# EAGLE board smrf-v1.0.1b (EAGLE 7.3.0), part 1 of 3
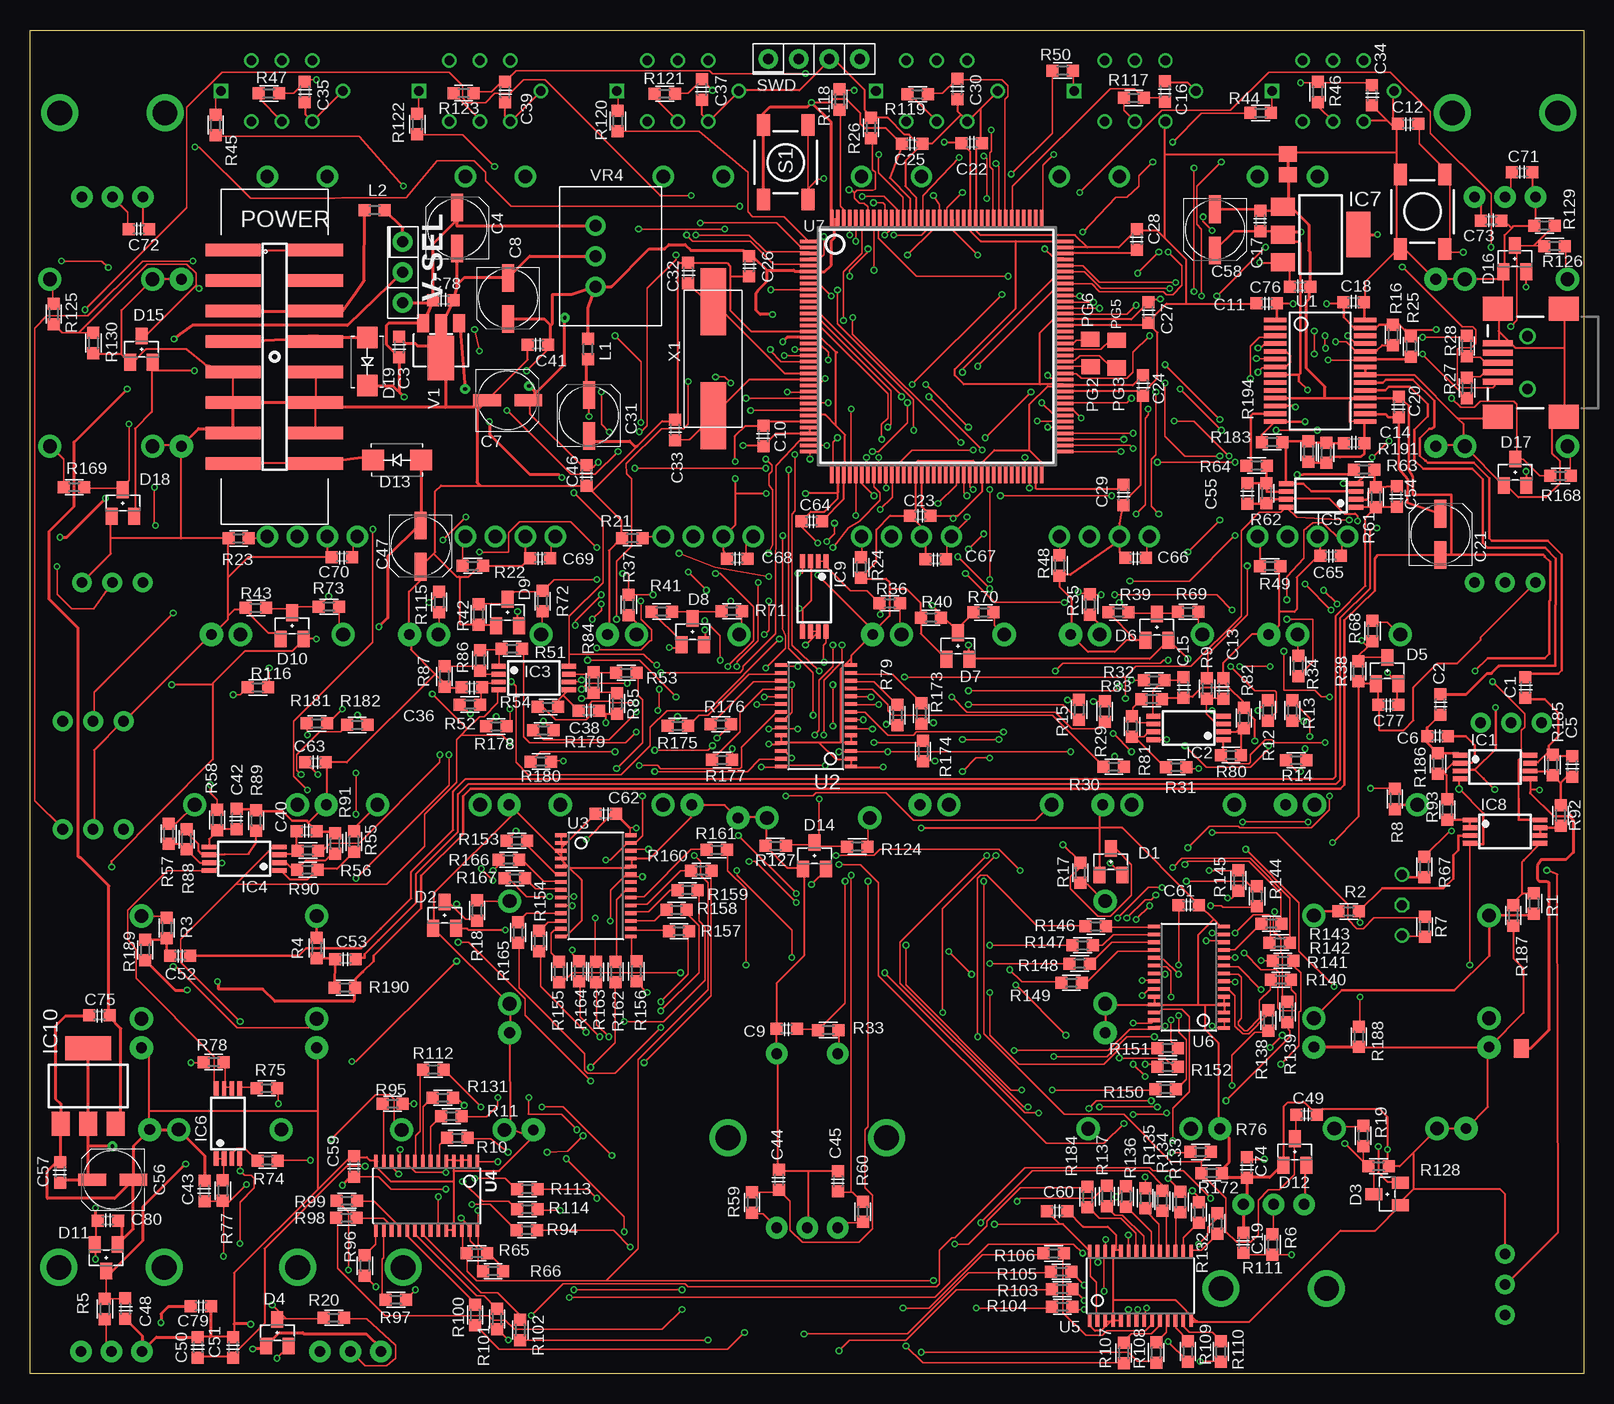
[diagram p6: board, top side]
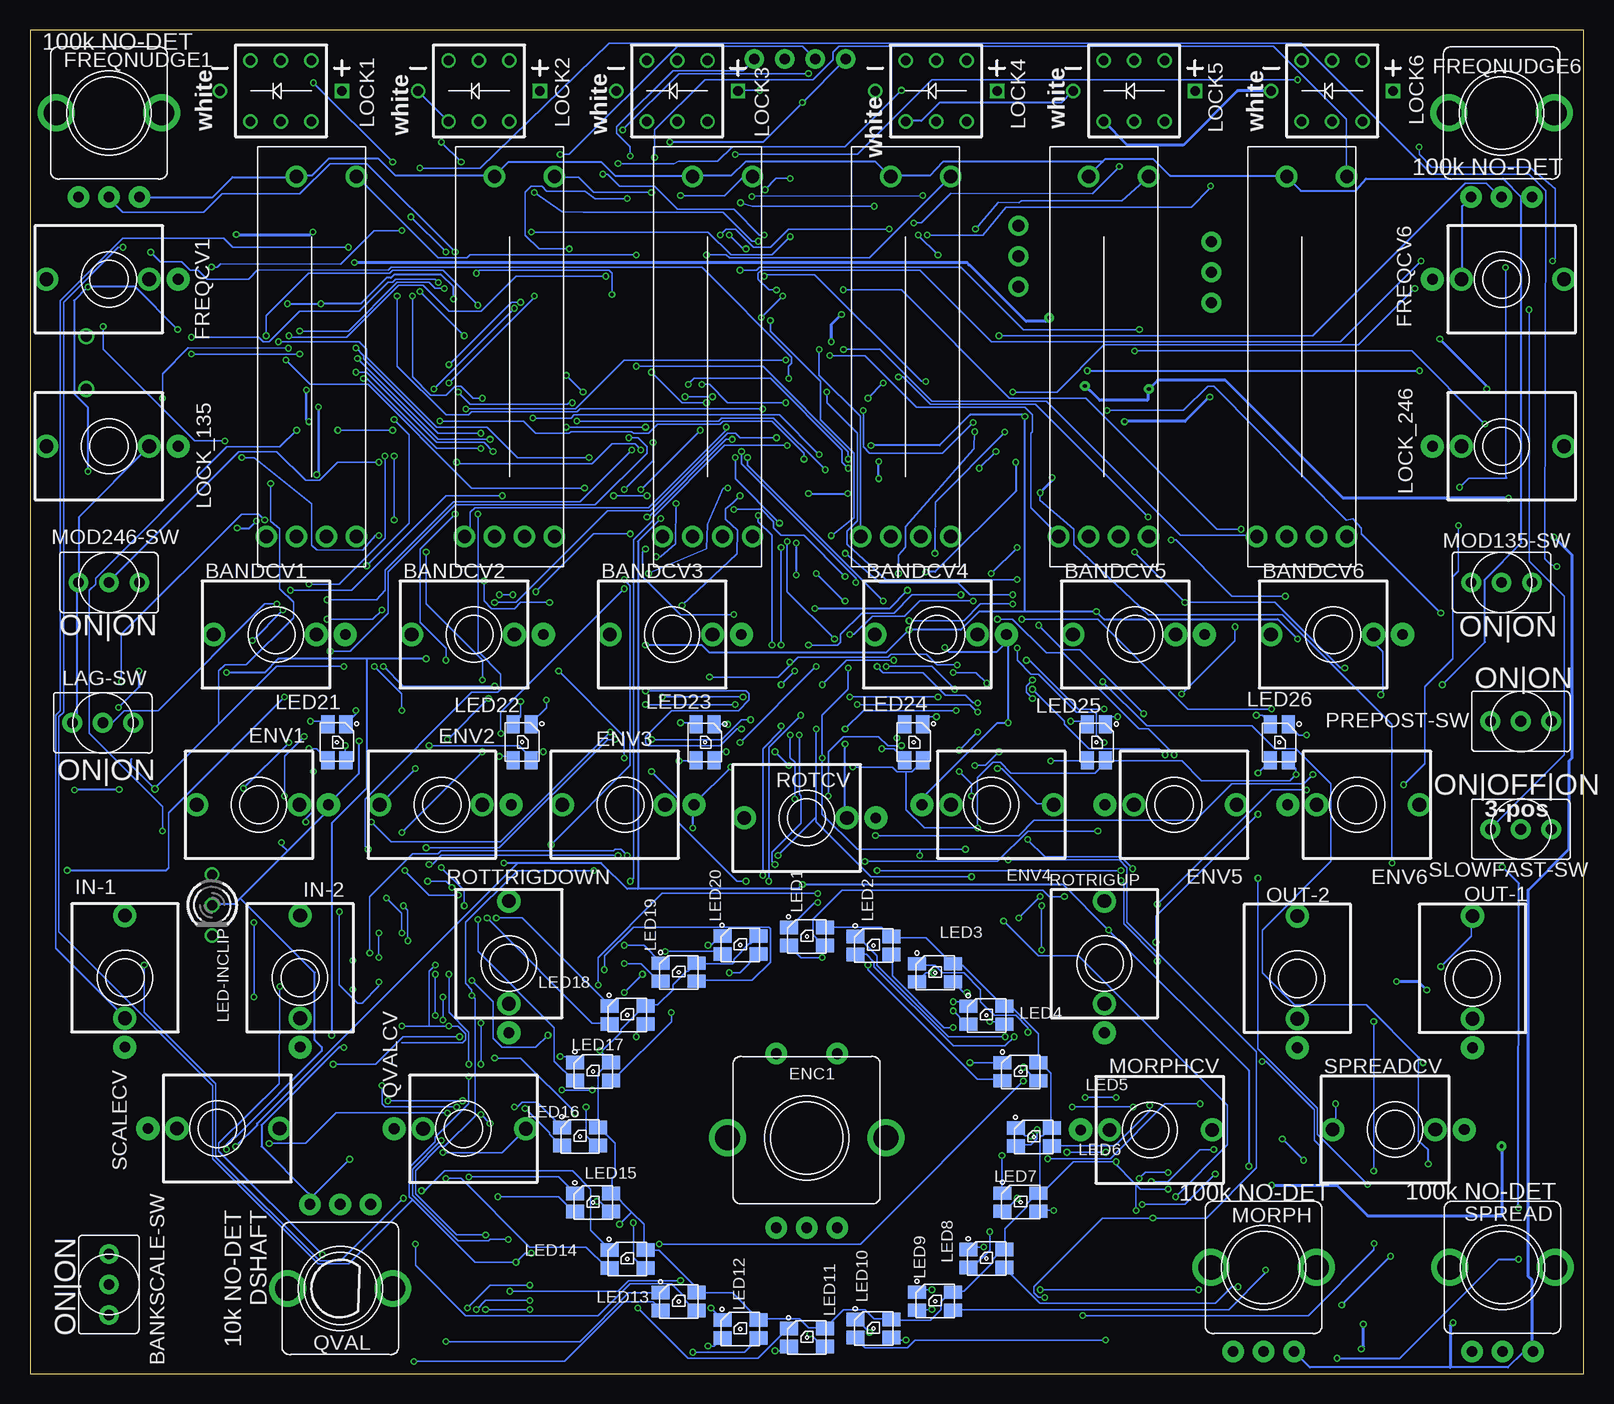
[diagram p7: board, bottom side, seen from below]

Size 129.54 x 111.96 mm. Coordinates in mm from the lower left corner, seen from the top.
Outline: 0,0 0,111.96 129.54,111.96 129.54,0 0,0
Copper layers (1*16): Top 0.035mm / dielectric 1.5mm / Bottom 0.035mm
Design rules "default *": minimum track width 5mil, minimum drill 12mil, track to track 5mil, track to pad 5mil, pad to pad 5mil, via to via 5mil, smd to smd 5mil, copper to edge 10mil, drill to drill 5mil, minimum pad ring 5mil, minimum via ring 5mil, stop-mask expansion 4mil, vias tented up to drill 12mil, thermal gap 5mil
Net classes: 1 power: width 0.178 mm, drill 0.305 mm, clearance 0.178 mm to class 0, clearance 0.178 mm

## Footprints (pad centres in the part's own frame; a part is rotated, then mirrored left to right if it is on the bottom)
PAD-06 = smd 1.524 x 1.27: P$1 0,0
PJ301M-12-FIX = drill 1.143 pad 1.93: 1 -5.207,0; 3 3.353,0 | drill 0.889 pad 1.93: 2 5.766,0
SPDT-SUB = drill 0.889 pad 1.651: P$1 0,2.54; P$2 0,0; P$3 0,-2.54
C0603 = smd 1 x 1: 1 -0.85,0; 2 0.85,0
C-POL-5 = smd 2.3 x 1: + 1.725,0; - -1.7,0
SOT23 = smd 1 x 1.4: 1 -0.95,-1.1; 2 0.95,-1.1; 3 0,1.1
SMA = smd 1.8 x 1.7: A -2,0; K 2,0
ROTENC-12MM-BUT = drill 0.889 pad 1.803: 1 -2.54,-7.493; 2 0,-7.493; 3 2.54,-7.493; SW1 -2.54,7.01; SW2 2.54,7.01 | drill 2.057 pad 2.667: P$4 -6.604,0; P$5 6.604,0
POT-9MM-SONGHUEI = drill 0.889 pad 1.803: 1 -2.54,-7.01; 2 0,-7.01; 3 2.54,-7.01 | drill 2.057 pad 2.667: P$4 -4.394,0; P$5 4.394,0
TSSOP8 = smd 0.4 x 1.2: 1 -0.975,-2.925; 2 -0.325,-2.925; 3 0.325,-2.925; 4 0.975,-2.925; 5 0.975,2.925; 6 0.325,2.925; 7 -0.325,2.925; 8 -0.975,2.925
SOT223 = smd 1.5 x 2: 1 -2.3,-3.15; 2 0,-3.15; 3 2.3,-3.15 | smd 3.8 x 2: 4 0,3.15
0603 = smd 1 x 1: 1 -0.85,0; 2 0.85,0
PLCC4 = smd 1.5 x 1.1: P$1 -1.5,0.75; P$2 1.5,0.75; P$3 1.5,-0.75; P$4 -1.5,-0.75
LED-T1X2 = drill 0.813: A-1 2.54,0; A-3 -2.54,0 | drill 0.813 octagon: K-2 0,0
BUTTON-LED-PB61303 = drill 0.8: P$1 2.54,2.54; P$2 0,2.54; P$3 -2.54,2.54; P$4 2.54,-2.54; P$5 0,-2.54; P$6 -2.54,-2.54; P$8 -5.08,0 | drill 0.8 square: P$7 5.08,0
HEADER-2X8-SMT-SHROUDED = smd 1.016 x 4.572: 1 -8.89,-3.458; 2 -8.89,3.407; 3 -6.35,-3.458; 4 -6.35,3.407; 5 -3.81,-3.458; 6 -3.81,3.407; 7 -1.27,-3.458; 8 -1.27,3.407; 9 1.27,-3.458; 10 1.27,3.407; 11 3.81,-3.458; 12 3.81,3.407; 13 6.35,-3.458; 14 6.35,3.407; 15 8.89,-3.458; 16 8.89,3.407
R0603 = smd 1 x 1: 1 -0.85,0; 2 0.85,0
BUTTON-TACT-SKQG = smd 1.8 x 1.1: 1 -3.1,1.85; 2 3.1,1.85; 3 -3.1,-1.85; 4 3.1,-1.85
POT-SLIDER-ALPHA-RA2045F-20 = drill 1.1 pad 1.778: P$1 -15,1.25; P$2 -15,3.75; P$3 15,1.25; P$LEDA 15,-3.75; P$LEDC -15,-3.75; P$NC -15,-1.25
HEADER-1X4-TH = drill 0.9 pad 1.651: P$1 0,3.81; P$2 0,1.27; P$3 0,-1.27; P$4 0,-3.81
28-SSOP = smd 0.381 x 1.905: P$1 -4.55,-3.752; P$2 -3.9,-3.752; P$3 -3.25,-3.752; P$4 -2.6,-3.752; P$5 -1.95,-3.752; P$6 -1.3,-3.752; P$7 -0.65,-3.752; P$8 0,-3.752; P$9 0.65,-3.752; P$10 1.3,-3.752; P$11 1.95,-3.752; P$12 2.6,-3.752; P$13 3.25,-3.752; P$14 3.9,-3.752; P$15 3.9,3.752; P$16 3.25,3.752; P$17 2.6,3.752; P$18 1.95,3.752; P$19 1.3,3.752; P$20 0.65,3.752; P$21 0,3.752; P$22 -0.65,3.752; P$23 -1.3,3.752; P$24 -1.95,3.752; P$25 -2.6,3.752; P$26 -3.25,3.752; P$27 -3.9,3.752; P$28 -4.55,3.752
TSSOP28 = smd 0.305 x 0.991: 1 -4.225,-2.918; 2 -3.575,-2.918; 3 -2.925,-2.918; 4 -2.275,-2.918; 5 -1.625,-2.918; 6 -0.975,-2.918; 7 -0.325,-2.918; 8 0.325,-2.918; 9 0.975,-2.918; 10 1.625,-2.918; 11 2.275,-2.918; 12 2.925,-2.918; 13 3.575,-2.918; 14 4.225,-2.918; 15 4.225,2.918; 16 3.575,2.918; 17 2.925,2.918; 18 2.275,2.918; 19 1.625,2.918; 20 0.975,2.918; 21 0.325,2.918; 22 -0.325,2.918; 23 -0.975,2.918; 24 -1.625,2.918; 25 -2.275,2.918; 26 -2.925,2.918; 27 -3.575,2.918; 28 -4.225,2.918
LQFP144 = smd 0.3 x 1.6: 1 -8.75,-10.6; 2 -8.25,-10.6; 3 -7.75,-10.6; 4 -7.25,-10.6; 5 -6.75,-10.6; 6 -6.25,-10.6; 7 -5.75,-10.6; 8 -5.25,-10.6; 9 -4.75,-10.6; 10 -4.25,-10.6; 11 -3.75,-10.6; 12 -3.25,-10.6; 13 -2.75,-10.6; 14 -2.25,-10.6; 15 -1.75,-10.6; 16 -1.25,-10.6; 17 -0.75,-10.6; 18 -0.25,-10.6; 19 0.25,-10.6; 20 0.75,-10.6; 21 1.25,-10.6; 22 1.75,-10.6; 23 2.25,-10.6; 24 2.75,-10.6; 25 3.25,-10.6; 26 3.75,-10.6; 27 4.25,-10.6; 28 4.75,-10.6; 29 5.25,-10.6; 30 5.75,-10.6; 31 6.25,-10.6; 32 6.75,-10.6; 33 7.25,-10.6; 34 7.75,-10.6; 35 8.25,-10.6; 36 8.75,-10.6; 73 8.75,10.6; 74 8.25,10.6; 75 7.75,10.6; 76 7.25,10.6; 77 6.75,10.6; 78 6.25,10.6; 79 5.75,10.6; 80 5.25,10.6; 81 4.75,10.6; 82 4.25,10.6; 83 3.75,10.6; 84 3.25,10.6; 85 2.75,10.6; 86 2.25,10.6; 87 1.75,10.6; 88 1.25,10.6; 89 0.75,10.6; 90 0.25,10.6; 91 -0.25,10.6; 92 -0.75,10.6; 93 -1.25,10.6; 94 -1.75,10.6; 95 -2.25,10.6; 96 -2.75,10.6; 97 -3.25,10.6; 98 -3.75,10.6; 99 -4.25,10.6; 100 -4.75,10.6; 101 -5.25,10.6; 102 -5.75,10.6; 103 -6.25,10.6; 104 -6.75,10.6; 105 -7.25,10.6; 106 -7.75,10.6; 107 -8.25,10.6; 108 -8.75,10.6 | smd 1.6 x 0.3: 37 10.6,-8.75; 38 10.6,-8.25; 39 10.6,-7.75; 40 10.6,-7.25; 41 10.6,-6.75; 42 10.6,-6.25; 43 10.6,-5.75; 44 10.6,-5.25; 45 10.6,-4.75; 46 10.6,-4.25; 47 10.6,-3.75; 48 10.6,-3.25; 49 10.6,-2.75; 50 10.6,-2.25; 51 10.6,-1.75; 52 10.6,-1.25; 53 10.6,-0.75; 54 10.6,-0.25; 55 10.6,0.25; 56 10.6,0.75; 57 10.6,1.25; 58 10.6,1.75; 59 10.6,2.25; 60 10.6,2.75; 61 10.6,3.25; 62 10.6,3.75; 63 10.6,4.25; 64 10.6,4.75; 65 10.6,5.25; 66 10.6,5.75; 67 10.6,6.25; 68 10.6,6.75; 69 10.6,7.25; 70 10.6,7.75; 71 10.6,8.25; 72 10.6,8.75; 109 -10.6,8.75; 110 -10.6,8.25; 111 -10.6,7.75; 112 -10.6,7.25; 113 -10.6,6.75; 114 -10.6,6.25; 115 -10.6,5.75; 116 -10.6,5.25; 117 -10.6,4.75; 118 -10.6,4.25; 119 -10.6,3.75; 120 -10.6,3.25; 121 -10.6,2.75; 122 -10.6,2.25; 123 -10.6,1.75; 124 -10.6,1.25; 125 -10.6,0.75; 126 -10.6,0.25; 127 -10.6,-0.25; 128 -10.6,-0.75; 129 -10.6,-1.25; 130 -10.6,-1.75; 131 -10.6,-2.25; 132 -10.6,-2.75; 133 -10.6,-3.25; 134 -10.6,-3.75; 135 -10.6,-4.25; 136 -10.6,-4.75; 137 -10.6,-5.25; 138 -10.6,-5.75; 139 -10.6,-6.25; 140 -10.6,-6.75; 141 -10.6,-7.25; 142 -10.6,-7.75; 143 -10.6,-8.25; 144 -10.6,-8.75
USB-MINIB = smd 2.5 x 0.5: D+ 2.5,0; D- 2.5,0.8; GND 2.5,-1.6; ID 2.5,-0.8; VBUS 2.5,1.6 | smd 2.5 x 2: MTN1 -3,4.5; MTN2 2.5,4.5; MTN3 -3,-4.5; MTN4 2.5,-4.5 | drill 0.9 pad 1.306: P$1 0,2.2; P$2 0,-2.2
SOT89 = smd 1 x 1.5: 1 -1.5,-2; 3 1.5,-2 | smd 1 x 1.8: 2A 0,-1.85 | smd 2.2 x 3.7: 2B 0,0.9
HEADER-1X3-TH = drill 0.9 pad 1.651: P$1 0,2.54; P$2 0,0; P$3 0,-2.54
RECOM-DCDC = drill 1 pad 1.676: P$1 -2.54,0; P$2 0,0; P$3 2.54,0
HC-49/US = smd 5.588 x 2.108: 1 -4.75,0; 2 4.75,0

## Placement (x,y rotation side)
AGND  [PAD-06]  104.85,99.9 0 top
AGND-OPT  [PAD-06]  124.31,27.08 90 top
BANDCV1  PJ301-M12  [PJ301M-12-FIX]  109.02,61.59 0 bottom
BANDCV2  PJ301-M12  [PJ301M-12-FIX]  92.51,61.59 0 bottom
BANDCV3  PJ301-M12  [PJ301M-12-FIX]  76,61.59 0 bottom
BANDCV4  PJ301-M12  [PJ301M-12-FIX]  53.91,61.59 0 bottom
BANDCV5  PJ301-M12  [PJ301M-12-FIX]  37.4,61.59 0 bottom
BANDCV6  PJ301-M12  [PJ301M-12-FIX]  20.89,61.59 0 bottom
BANKSCALE-SW  submini-2T  [SPDT-SUB]  122.96,7.42 0 bottom
C1  10uF/10V  [C0603]  124.66,57.18 270 top
C2  10uF/10V  [C0603]  117.55,55.75 270 top
C3  0.1uF  [C0603]  30.78,85.55 90 top
C4  47uF  [C-POL-5]  35.61,95.45 90 top
C5  18pF  [C0603]  128.55,50.6 270 top
C6  18pF  [C0603]  117.32,53.11 0 top
C7  47uF  [C-POL-5]  39.8,81.1 0 top
C8  47uF  [C-POL-5]  39.85,89.61 270 top
C9  0.1uF  [C0603]  63.07,28.73 180 top
C10  0.1uF  [C0603]  61.14,78.13 90 top
C11  0.1uF  [C0603]  103.1,89.2 180 top
C12  0.1uF  [C0603]  114.88,104.14 180 top
C13  0.1uF  [C0603]  99.49,57.07 90 top
C14  2.2uF  [C0603]  110.36,77.55 0 top
C15  0.1uF  [C0603]  96.16,57.18 270 top
C16  0.1uF  [C0603]  94.61,106.83 90 top
C17  0.1uF  [C0603]  102.57,96.06 90 top
C18  0.1uF  [C0603]  110.34,89.28 0 top
C19  0.1uF  [C0603]  101.14,10.9 90 top
C20  0.1uF  [C0603]  114.1,80.54 90 top
C21  47uF  [C-POL-5]  117.58,69.93 90 top
C22  0.1uF  [C0603]  78.51,102.54 0 top
C23  0.1uF  [C0603]  74.22,71.5 180 top
C24  0.1uF  [C0603]  92.79,82.35 270 top
C25  0.1uF  [C0603]  73.53,102.46 0 top
C26  0.1uF  [C0603]  59.94,92.28 270 top
C27  0.1uF  [C0603]  93.22,88.42 270 top
C28  2.2uF  [C0603]  92.28,94.51 90 top
C29  2.2uF  [C0603]  91.14,73.23 270 top
C30  0.1uF  [C0603]  77.29,107.04 270 top
C31  47uF  [C-POL-5]  46.58,79.83 90 top
C32  18pF  [C0603]  54.86,91.72 270 top
C33  18pF  [C0603]  53.77,78.64 270 top
C34  0.1uF  [C0603]  111.86,106.53 270 top
C35  0.1uF  [C0603]  22.91,106.81 270 top
C36  0.1uF  [C0603]  36.83,57.18 180 top
C37  0.1uF  [C0603]  56.01,107.01 270 top
C38  0.1uF  [C0603]  46.58,55.22 0 top
C39  0.1uF  [C0603]  39.6,106.78 270 top
C40  0.1uF  [C0603]  23.06,45.21 0 top
C41  0.1uF  [C0603]  42.34,85.75 180 top
C42  0.1uF  [C0603]  17.22,46.23 90 top
C43  0.1uF  [C0603]  14.55,15.21 90 top
C44  0.1uF  [C0603]  62.43,16.15 90 top
C45  0.1uF  [C0603]  67.36,16.03 90 top
C46  0.1uF  [C0603]  46.41,74.85 90 top
C47  47uF  [C-POL-5]  32.56,68.96 270 top
C48  0.1uF  [C0603]  7.95,5.41 270 top
C49  0.1uF  [C0603]  106.4,21.56 0 top
C50  0.1uF  [C0603]  14,2.18 90 top
C51  18pF  [C0603]  16.94,2.18 90 top
C52  10uF/10V  [C0603]  12.52,34.82 180 top
C53  10uF/10V  [C0603]  26.29,34.54 180 top
C54  18pF  [C0603]  113.92,73.08 90 top
C55  18pF  [C0603]  101.5,73.33 90 top
C56  47uF  [C-POL-5]  6.91,16.15 180 top
C57  0.1uF  [C0603]  2.51,16.76 90 top
C58  47uF  [C-POL-5]  98.78,95.33 270 top
C59  0.1uF  [C0603]  27.03,17.25 90 top
C60  0.1uF  [C0603]  85.62,13.51 0 top
C61  0.1uF  [C0603]  96.57,39.01 0 top
C62  0.1uF  [C0603]  48.01,46.63 180 top
C63  0.1uF  [C0603]  23.8,50.93 0 top
C64  0.1uF  [C0603]  65.15,71.04 180 top
C65  0.1uF  [C0603]  108.43,68.15 180 top
C66  0.1uF  [C0603]  92.15,67.97 180 top
C67  0.1uF  [C0603]  75.49,67.84 180 top
C68  0.1uF  [C0603]  58.95,67.92 180 top
C69  0.1uF  [C0603]  42.52,67.94 180 top
C70  0.1uF  [C0603]  26.01,68.02 180 top
C71  0.1uF  [C0603]  124.38,100.1 0 top
C72  0.1uF  [C0603]  9.07,95.35 0 top
C73  0.1uF  [C0603]  121.79,96.09 0 top
C74  0.1uF  [C0603]  101.42,17.17 270 top
C75  0.1uF  [C0603]  5.79,29.84 180 top
C76  0.1uF  [C0603]  105.87,90.58 0 top
C77  0.1uF  [C0603]  113.23,55.73 180 top
C78  0.1uF  [C0603]  34.47,89.46 0 top
C79  0.1uF  [C0603]  14.25,5.61 180 top
C80  0.1uF  [C0603]  6.5,12.75 0 top
D1  BAT54S  [SOT23]  90.09,42.65 0 top
D2  BAT54S  [SOT23]  34.57,38.2 0 top
D3  BAT54S  [SOT23]  113.13,14.96 90 top
D4  BAT54S  [SOT23]  20.62,3.4 0 top
D5  BAT54S  [SOT23]  113.13,58.57 0 top
D6  BAT54S  [SOT23]  93.93,62.2 0 top
D7  BAT54S  [SOT23]  77.34,60.63 0 top
D8  BAT54S  [SOT23]  55.24,61.82 0 top
D9  BAT54S  [SOT23]  39.8,63.42 0 top
D10  BAT54S  [SOT23]  21.84,62.31 0 top
D11  BAT54S  [SOT23]  6.35,9.65 180 top
D12  BAT54S  [SOT23]  105.44,18.47 0 top
D13  B140-E3  [SMA]  30.61,76.12 180 top
D14  BAT54S  [SOT23]  65.41,43.15 0 top
D15  BAT54S  [SOT23]  9.3,85.37 0 top
D16  BAT54S  [SOT23]  123.77,92.91 0 top
D17  BAT54S  [SOT23]  123.8,75.11 0 top
D18  BAT54S  [SOT23]  7.75,72.54 0 top
D19  B140-E3  [SMA]  28.12,84.33 270 top
DGND  [PAD-06]  104.85,101.63 0 top
ENC1  ROTENC-BUTTON-A  [ROTENC-12MM-BUT]  64.79,19.65 0 bottom
ENV1  PJ301-M12  [PJ301M-12-FIX]  110.43,47.4 0 bottom
ENV2  PJ301-M12  [PJ301M-12-FIX]  95.19,47.4 0 bottom
ENV3  PJ301-M12  [PJ301M-12-FIX]  79.95,47.4 0 bottom
ENV4  PJ301-M12  [PJ301M-12-FIX]  49.41,47.4 180 bottom
ENV5  PJ301-M12  [PJ301M-12-FIX]  34.17,47.4 180 bottom
ENV6  PJ301-M12  [PJ301M-12-FIX]  18.93,47.4 180 bottom
FREQCV1  PJ301-M12  [PJ301M-12-FIX]  122.96,91.19 0 bottom
FREQCV6  PJ301-M12  [PJ301M-12-FIX]  6.87,91.19 180 bottom
FREQNUDGE1  100k  [POT-9MM-SONGHUEI]  122.96,105.05 0 bottom
FREQNUDGE6  100k  [POT-9MM-SONGHUEI]  6.87,105.05 0 bottom
IC1  TL082  [TSSOP8]  122.12,50.55 270 top
IC2  TL082  [TSSOP8]  96.57,53.8 90 top
IC3  TL082  [TSSOP8]  41.99,57.96 270 top
IC4  TL082  [TSSOP8]  17.86,42.9 90 top
IC5  TL082  [TSSOP8]  107.62,73.18 90 top
IC6  TL082  [TSSOP8]  16.5,20.84 0 top
IC7  LD1117-33  [SOT223]  107.59,94.92 270 top
IC8  TL082  [TSSOP8]  122.96,45.16 270 top
IC9  TL082  [TSSOP8]  65.38,64.77 180 top
IC10  LD1117-33  [SOT223]  4.85,23.95 0 top
IN-1  PJ301-M12  [PJ301M-12-FIX]  121.63,32.97 270 bottom
IN-2  PJ301-M12  [PJ301M-12-FIX]  107.03,32.97 270 bottom
L1  BEAD  [0603]  46.51,85.37 270 top
L2  BEAD  [0603]  28.73,96.95 0 top
LAG-SW  submini-2T  [SPDT-SUB]  123.47,54.23 90 bottom
LED1  LED-RGB-CA-HEBEI  [PLCC4]  64.78,36.43 0 bottom
LED2  LED-RGB-CA-HEBEI  [PLCC4]  59.22,35.68 0 bottom
LED3  LED-RGB-CA-HEBEI  [PLCC4]  54.09,33.4 0 bottom
LED4  LED-RGB-CA-HEBEI  [PLCC4]  49.8,29.85 0 bottom
LED5  LED-RGB-CA-HEBEI  [PLCC4]  46.96,25.14 0 bottom
LED6  LED-RGB-CA-HEBEI  [PLCC4]  45.86,19.72 0 bottom
LED7  LED-RGB-CA-HEBEI  [PLCC4]  46.96,14.29 0 bottom
LED8  LED-RGB-CA-HEBEI  [PLCC4]  49.8,9.58 0 bottom
LED9  LED-RGB-CA-HEBEI  [PLCC4]  54.09,6.03 0 bottom
LED10  LED-RGB-CA-HEBEI  [PLCC4]  59.22,3.75 0 bottom
LED11  LED-RGB-CA-HEBEI  [PLCC4]  64.78,3 0 bottom
LED12  LED-RGB-CA-HEBEI  [PLCC4]  70.33,3.72 0 bottom
LED13  LED-RGB-CA-HEBEI  [PLCC4]  75.46,6 0 bottom
LED14  LED-RGB-CA-HEBEI  [PLCC4]  79.75,9.55 0 bottom
LED15  LED-RGB-CA-HEBEI  [PLCC4]  82.59,14.25 0 bottom
LED16  LED-RGB-CA-HEBEI  [PLCC4]  83.69,19.75 0 bottom
LED17  LED-RGB-CA-HEBEI  [PLCC4]  82.59,25.18 0 bottom
LED18  LED-RGB-CA-HEBEI  [PLCC4]  79.75,29.88 0 bottom
LED19  LED-RGB-CA-HEBEI  [PLCC4]  75.46,33.43 0 bottom
LED20  LED-RGB-CA-HEBEI  [PLCC4]  70.33,35.71 0 bottom
LED21  LED-RGB-CA-HEBEI  [PLCC4]  103.95,52.62 270 bottom
LED22  LED-RGB-CA-HEBEI  [PLCC4]  88.52,52.63 270 bottom
LED23  LED-RGB-CA-HEBEI  [PLCC4]  73.28,52.6 270 bottom
LED24  LED-RGB-CA-HEBEI  [PLCC4]  55.88,52.62 270 bottom
LED25  LED-RGB-CA-HEBEI  [PLCC4]  40.64,52.6 270 bottom
LED26  LED-RGB-CA-HEBEI  [PLCC4]  25.4,52.6 270 bottom
LED-INCLIP  LEDX2A  [LED-T1X2]  114.36,39.03 270 bottom
LOCK1  WHITE-MOM  [BUTTON-LED-PB61303]  108.62,106.89 0 bottom
LOCK2  WHITE-MOM  [BUTTON-LED-PB61303]  92.11,106.89 0 bottom
LOCK3  WHITE-MOM  [BUTTON-LED-PB61303]  75.6,106.89 0 bottom
LOCK4  WHITE-MOM  [BUTTON-LED-PB61303]  54.01,106.89 0 bottom
LOCK5  WHITE-MOM  [BUTTON-LED-PB61303]  37.5,106.89 0 bottom
LOCK6  WHITE-MOM  [BUTTON-LED-PB61303]  20.99,106.89 0 bottom
LOCK_135  PJ301-M12  [PJ301M-12-FIX]  122.96,77.28 0 bottom
LOCK_246  PJ301-M12  [PJ301M-12-FIX]  6.87,77.28 180 bottom
MOD135-SW  submini-2T  [SPDT-SUB]  6.87,65.92 270 bottom
MOD246-SW  submini-2T  [SPDT-SUB]  122.96,65.92 90 bottom
MORPH  100k  [POT-9MM-SONGHUEI]  26.71,8.84 0 bottom
MORPHCV  PJ301-M12  [PJ301M-12-FIX]  36.2,20.3 180 bottom
OUT-1  PJ301-M12  [PJ301M-12-FIX]  9.29,32.92 270 bottom
OUT-2  PJ301-M12  [PJ301M-12-FIX]  23.89,32.92 270 bottom
PG2  [PAD-06]  88.42,83.9 0 top
PG3  [PAD-06]  90.58,83.79 180 top
PG5  [PAD-06]  90.58,86.11 0 top
PG6  [PAD-06]  88.37,86.18 180 top
POWER  HEADER-2X8-SMT  [HEADER-2X8-SMT-SHROUDED]  20.4,84.73 270 top
PREPOST-SW  submini-2T  [SPDT-SUB]  5.26,54.36 90 bottom
QVAL  100k  [POT-9MM-SONGHUEI]  103.68,7.09 180 bottom
QVALCV  PJ301-M12  [PJ301M-12-FIX]  93.42,20.41 180 bottom
R1  1k  [R0603]  125.37,39.17 90 top
R2  1k  [R0603]  109.93,38.51 0 top
R3  1k  [R0603]  11.4,37.13 270 top
R4  1k  [R0603]  23.9,35.46 270 top
R5  49k  [R0603]  6.25,5.38 90 top
R6  10k  [R0603]  103.58,10.74 270 top
R7  1k  [R0603]  116.26,37.24 90 top
R8  1k  [R0603]  113.77,47.88 90 top
R9  10k  [R0603]  98.12,57.07 90 top
R10  1k  [R0603]  35.64,19.63 0 top
R11  1k  [R0603]  35.13,21.44 0 top
R12  1k  [R0603]  103.17,55.27 90 top
R13  1k  [R0603]  105.23,55.24 270 top
R14  1k  [R0603]  105.54,51.1 0 top
R15  1k  [R0603]  87.45,55.32 90 top
R16  4k7  [R0603]  113.61,86.56 270 top
R17  1k  [R0603]  87.55,41.73 90 top
R18  1k  [R0603]  37.26,38.58 270 top
R19  49k  [R0603]  111.12,19.81 270 top
R20  49k  [R0603]  25.32,4.65 180 top
R21  1k  [R0603]  50.22,69.62 180 top
R22  1k  [R0603]  36.91,67.31 0 top
R23  1k  [R0603]  17.4,69.6 180 top
R24  1k  [R0603]  69.29,67.18 270 top
R25  4k7  [R0603]  115.11,85.6 270 top
R26  10k  [R0603]  70.1,103.81 90 top
R27  22  [R0603]  119.79,82.12 90 top
R28  22  [R0603]  119.76,85.62 270 top
R29  1k  [R0603]  89.59,55.17 90 top
R30  1k  [R0603]  90.35,50.57 0 top
R31  1k  [R0603]  95.55,50.52 180 top
R32  10k  [R0603]  93.7,57.76 180 top
R33  10k  [R0603]  66.55,28.63 180 top
R34  1k  [R0603]  105.71,58.95 270 top
R35  1k  [R0603]  88.37,64.08 90 top
R36  1k  [R0603]  71.68,64.19 180 top
R37  1k  [R0603]  49.91,64.06 90 top
R38  100k  [R0603]  110.72,58.52 270 top
R39  100k  [R0603]  90.73,63.42 180 top
R40  100k  [R0603]  75.11,62.99 180 top
R41  100k  [R0603]  52.65,63.5 180 top
R42  100k  [R0603]  37.39,63.27 270 top
R43  100k  [R0603]  18.82,63.8 180 top
R44  330  [R0603]  102.59,105.05 0 top
R45  330  [R0603]  15.47,104.04 90 top
R46  1k  [R0603]  107.34,106.81 270 top
R47  1k  [R0603]  19.91,106.68 180 top
R48  1k  [R0603]  85.83,67.34 270 top
R49  1k  [R0603]  103.38,67.28 0 top
R50  330  [R0603]  86.08,108.58 0 top
R51  1k  [R0603]  40.18,60.4 180 top
R52  10k  [R0603]  36.68,55.75 180 top
R53  1k  [R0603]  49.71,58.39 180 top
R54  10k  [R0603]  43.18,55.55 180 top
R55  1k  [R0603]  27,44.35 270 top
R56  10k  [R0603]  23.16,43.59 0 top
R57  1k  [R0603]  11.56,44.98 270 top
R58  10k  [R0603]  15.61,46.14 90 top
R59  10k  [R0603]  60.2,14.25 90 top
R60  10k  [R0603]  69.42,13.49 270 top
R61  100k  [R0603]  112.19,73.03 270 top
R62  100k  [R0603]  103.07,73.36 270 top
R63  10k  [R0603]  111.2,75.34 0 top
R64  10k  [R0603]  102.26,75.67 0 top
R65  4k7  [R0603]  37.26,10.03 180 top
R66  4k7  [R0603]  38.61,8.53 180 top
R67  1k  [R0603]  116.23,42.21 270 top
R68  49k  [R0603]  111.91,61.87 90 top
R69  49k  [R0603]  96.55,63.47 0 top
R70  49k  [R0603]  79.48,63.42 0 top
R71  49k  [R0603]  58.5,63.53 0 top
R72  49k  [R0603]  42.72,64.36 270 top
R73  49k  [R0603]  24.92,63.91 0 top
R74  1k  [R0603]  19.81,17.75 180 top
R75  1k  [R0603]  19.74,23.77 180 top
R76  49k  [R0603]  97.59,18.47 0 top
R77  100k  [R0603]  16.08,15.24 270 top
R78  100k  [R0603]  15.32,25.96 180 top
R79  1k  [R0603]  72.31,54.86 270 top
R80  100k  [R0603]  100.1,51.54 0 top
R81  100k  [R0603]  91.87,53.92 90 top
R82  68k  [R0603]  101.19,54.64 90 top
R83  68k  [R0603]  93.5,56.21 0 top
R84  100k  [R0603]  46.99,57.58 270 top
R85  68k  [R0603]  48.95,55.83 270 top
R86  100k  [R0603]  37.52,59.44 270 top
R87  68k  [R0603]  34.54,58.09 270 top
R88  100k  [R0603]  13.06,44.53 90 top
R89  68k  [R0603]  18.85,46.08 90 top
R90  100k  [R0603]  23.14,41.99 180 top
R91  68k  [R0603]  25.43,44.17 90 top
R92  100k  [R0603]  127.58,46.51 90 top
R93  100k  [R0603]  118.14,46.99 90 top
R94  1k  [R0603]  41.43,11.94 0 top
R95  1k  [R0603]  30.23,22.48 0 top
R96  1k  [R0603]  27.91,8.99 270 top
R97  1k  [R0603]  30.51,6.15 0 top
R98  1k  [R0603]  26.39,12.98 180 top
R99  1k  [R0603]  26.42,14.4 180 top
R100  1k  [R0603]  37.11,4.88 270 top
R101  1k  [R0603]  38.94,4.55 270 top
R102  1k  [R0603]  40.87,3.63 270 top
R103  1k  [R0603]  86.06,5.56 180 top
R104  1k  [R0603]  86.03,7.04 180 top
R105  1k  [R0603]  85.95,8.48 180 top
R106  1k  [R0603]  85.34,10.01 180 top
R107  1k  [R0603]  91.17,1.71 270 top
R108  1k  [R0603]  93.88,1.75 270 top
R109  1k  [R0603]  96.52,1.83 270 top
R110  1k  [R0603]  99.26,1.83 270 top
R111  1k  [R0603]  98.96,12.5 90 top
R112  1k  [R0603]  33.63,25.32 0 top
R113  1k  [R0603]  41.45,15.37 0 top
R114  1k  [R0603]  41.45,13.69 0 top
R115  1k  [R0603]  34.11,64.29 90 top
R116  1k  [R0603]  19,57.18 0 top
R117  1k  [R0603]  92.02,106.3 180 top
R118  330  [R0603]  67.49,106.17 90 top
R119  1k  [R0603]  73.99,106.6 180 top
R120  330  [R0603]  49,104.37 90 top
R121  1k  [R0603]  52.91,106.65 180 top
R122  330  [R0603]  32.28,104.11 90 top
R123  1k  [R0603]  36.14,106.71 180 top
R124  200k?  [R0603]  68.96,43.92 180 top
R125  200k?  [R0603]  1.98,88.29 270 top
R126  49k  [R0603]  127.08,93.95 180 top
R127  100k  [R0603]  62.15,43.97 180 top
R128  100k  [R0603]  112.42,17.27 0 top
R129  100k  [R0603]  126.24,95.66 180 top
R130  100k  [R0603]  5.28,85.88 270 top
R131  1k  [R0603]  34.42,22.99 0 top
R132  1k  [R0603]  97.43,13.44 90 top
R133  1k  [R0603]  95.91,14.3 90 top
R134  1k  [R0603]  94.39,14.4 90 top
R135  1k  [R0603]  92.96,14.61 90 top
R136  1k  [R0603]  91.36,14.76 90 top
R137  1k  [R0603]  89.76,14.78 90 top
R138  1k  [R0603]  103.23,29.41 270 top
R139  1k  [R0603]  104.83,30.12 270 top
R140  1k  [R0603]  104.27,32.82 0 top
R141  1k  [R0603]  104.44,34.39 0 top
R142  1k  [R0603]  104.17,35.92 0 top
R143  1k  [R0603]  103.48,37.49 0 top
R144  1k  [R0603]  102.29,39.78 90 top
R145  1k  [R0603]  100.74,41.1 90 top
R146  1k  [R0603]  88.85,37.26 180 top
R147  1k  [R0603]  87.76,35.69 180 top
R148  1k  [R0603]  87.5,34.16 180 top
R149  1k  [R0603]  86.82,32.56 180 top
R150  1k  [R0603]  94.67,23.7 180 top
R151  1k  [R0603]  94.84,27.13 180 top
R152  1k  [R0603]  94.84,25.55 0 top
R153  1k  [R0603]  40.59,44.4 180 top
R154  1k  [R0603]  42.44,36.04 270 top
R155  1k  [R0603]  44.12,33.48 270 top
R156  1k  [R0603]  50.55,33.53 270 top
R157  1k  [R0603]  54.1,36.86 0 top
R158  1k  [R0603]  53.9,38.63 0 top
R159  1k  [R0603]  54.81,40.28 0 top
R160  1k  [R0603]  55.96,41.91 0 top
R161  1k  [R0603]  57.25,43.64 0 top
R162  1k  [R0603]  48.82,33.48 270 top
R163  1k  [R0603]  47.19,33.45 270 top
R164  1k  [R0603]  45.77,33.53 270 top
R165  1k  [R0603]  40.69,36.75 270 top
R166  1k  [R0603]  39.9,42.82 180 top
R167  1k  [R0603]  40.41,41.27 180 top
R168  1k  [R0603]  127.58,74.8 180 top
R169  1k  [R0603]  3.68,73.86 0 top
R172  100k  [R0603]  98.5,16.71 0 top
R173  1k  [R0603]  74.3,55.02 270 top
R174  1k  [R0603]  74.45,51.87 270 top
R175  1k  [R0603]  54,53.98 180 top
R176  1k  [R0603]  57.58,54.1 0 top
R177  1k  [R0603]  57.68,51.13 0 top
R178  1k  [R0603]  38.86,53.92 180 top
R179  1k  [R0603]  42.8,53.59 0 top
R180  1k  [R0603]  42.6,51 0 top
R181  1k  [R0603]  23.93,54.18 180 top
R182  1k  [R0603]  27.28,54.05 0 top
R183  49k  [R0603]  103.53,77.62 180 top
R184  1k  [R0603]  88.16,14.71 90 top
R185  10k  [R0603]  126.92,50.72 90 top
R186  10k  [R0603]  117.37,50.83 90 top
R187  1M  [R0603]  123.65,38.18 270 top
R188  1M  [R0603]  110.77,28.07 270 top
R189  100k  [R0603]  9.6,35.31 270 top
R190  100k  [R0603]  26.26,32.16 0 top
R191  68k  [R0603]  108.05,76.73 90 top
R194  100k  [R0603]  106.58,76.83 90 top
ROTCV  PJ301-M12  [PJ301M-12-FIX]  64.79,46.3 0 bottom
ROTRIGUP  PJ301-M12  [PJ301M-12-FIX]  39.98,34.16 270 bottom
ROTTRIGDOWN  PJ301-M12  [PJ301M-12-FIX]  89.62,34.16 270 bottom
S0  BUTTON-TACT  [BUTTON-TACT-SKQG]  116.08,96.82 90 top
S1  BUTTON-TACT  [BUTTON-TACT-SKQG]  62.99,100.94 270 top
SCALECV  PJ301-M12  [PJ301M-12-FIX]  113.94,20.43 180 bottom
SLIDE1  100k  [POT-SLIDER-ALPHA-RA2045F-20]  106.08,84.75 90 bottom
SLIDE2  100k  [POT-SLIDER-ALPHA-RA2045F-20]  89.57,84.75 90 bottom
SLIDE3  100k  [POT-SLIDER-ALPHA-RA2045F-20]  73.06,84.75 90 bottom
SLIDE4  100k  [POT-SLIDER-ALPHA-RA2045F-20]  56.55,84.75 90 bottom
SLIDE5  100k  [POT-SLIDER-ALPHA-RA2045F-20]  40.04,84.75 90 bottom
SLIDE6  100k  [POT-SLIDER-ALPHA-RA2045F-20]  23.53,84.75 90 bottom
SLOWFAST-SW  submini-3T  [SPDT-SUB]  5.26,45.36 90 bottom
SPREAD  100k  [POT-9MM-SONGHUEI]  6.8,8.84 0 bottom
SPREADCV  PJ301-M12  [PJ301M-12-FIX]  15.74,20.33 0 bottom
SWD  HEADER-1X4  [HEADER-1X4-TH]  65.35,109.55 90 top
U1  WM8731  [28-SSOP]  107.54,83.24 270 top
U2  PCA9685  [TSSOP28]  65.51,54.81 90 top
U3  PCA9685  [TSSOP28]  47.17,40.64 270 top
U4  PCA9685  [TSSOP28]  33.07,14.81 180 top
U5  PCA9685  [TSSOP28]  92.56,7.32 0 top
U6  PCA9685  [TSSOP28]  96.6,33.02 90 top
U7  STM32F427ZG  [LQFP144]  75.59,85.6 270 top
U$1  USB-MINIB-5PIN  [USB-MINIB]  124.84,84.25 180 top
V1  KA78L05  [SOT89]  34.26,85.52 180 top
V-SEL  HEADER-1X3-TH  [HEADER-1X3-TH]  31.06,91.77 0 top
VR4  78E-3.3-0.5  [RECOM-DCDC]  47.14,93.12 270 top
X1  8MHz  [HC-49/US]  56.95,84.56 270 top

## Tracks (layer width: path | path; a pad name or v marks a point on that pad's centre or on a via)
5VEXT
  Top 0.254: V-SEL.P$1 31.06,95.47 L2.2
5VREF1  (via drill 0.3)
  Top 0.127: IC9.2 IC9.1 66.36,67.28 68.38,65.25 69.76,65.25 R36.2 70.87,64.14 v70.87,63.25 | v104.78,62.87 106.93,62.87 106.93,59.31 105.79,58.17 R34.2 | v100.2,63.63 98.93,64.9 v90.42,64.9 | v89.28,64.9 88.39,64.9 R35.2 88.27,65.02 87.5,65.02 v87.38,65.15 | v79.5,69.98 v78.23,68.71
  Bottom 0.127: v104.78,62.87 100.97,62.87 v100.2,63.63 | v89.28,64.9 v90.42,64.9 | v70.87,63.25 75.31,63.25 78.49,66.42 78.49,68.45 v78.23,68.71 | v79.5,69.98 82.55,69.98 v87.38,65.15
5VREF2  (via drill 0.3)
  Top 0.127: IC9.6 IC9.7 65.66,61.72 v64.64,60.71 | v51.94,64.9 49.91,64.9 R37.2 49.91,66.67 v49.4,66.67 | v19.94,58.8 19.94,57.28 R116.2 | v33.27,64.26 34.04,65.02 R115.2 | v47.24,68.83 45.06,70.99 40.82,70.99 39.88,70.05 39.88,68.45 v37.47,68.45
  Bottom 0.127: v51.94,64.9 56.01,64.9 57.53,63.37 60.2,63.37 61.98,61.59 61.98,60.96 62.23,60.71 v64.64,60.71 | v19.94,58.8 20.32,58.8 25.78,64.26 v33.27,64.26 v37.47,68.45 | v47.24,68.83 v49.4,66.67
+3.3V  (via drill 0.3)
  Top 0.178: C24.1 91.94,82.35 U7.84 | U7.52 74.34,72.23 C23.1 76.96,71.5 | C64.1 67.84,72.88 U7.39 67.82,75.06 67.82,75.82 67.94,75.95 67.94,78.23 67.18,78.99 | U7.131 73.34,97.96 71.68,99.64 72.75,102.4 C25.1 72.64,102.49 71.37,103.76 69.6,103.76 69.22,104.14 69.22,105.03 68.07,106.17 66.93,106.17 66.67,105.92 v65.15,105.92 | C26.1 | C50.1 14.1,1.4 16.89,1.4 C51.1 17.02,1.4 17.02,1.65 19.56,4.19 19.56,10.41 26.42,17.27 v27.94,17.27 | v39.62,36.96 36.58,36.96 36.45,37.08 35.56,37.08 D2.2 | v65.15,40.77 66.42,42.04 D14.2 | v90.04,42.55 90.93,41.66 D1.2 | v112.39,18.92 112.39,16.76 113.16,16 114.17,16 D3.2 | v124.71,90.55 124.71,91.69 D16.2 | v117.22,87 114.68,87 114.62,86.94 | v124.71,75.18 124.71,74.04 D17.2 | v105.28,89.15 104.01,89.15 C11.1 | v108.08,89.15 109.47,89.15 C18.1 | 67.18,78.99 66.29,79.88 65.02,79.88 U7.30 | 67.18,85.09 65.91,86.36 65.02,86.36 U7.17 | 67.18,78.99 67.18,85.09 | 82.17,94.36 79.25,94.36 78.36,95.25 78.36,96.14 U7.121 78.34,101.86 C22.1 77.6,102.62 v76.2,102.62 | 82.17,94.36 86.11,94.36 U7.108 | 76.96,71.5 77.34,71.5 79.38,73.53 79.38,74.93 U7.62 79.38,75.06 79.38,75.95 80.39,76.96 83.31,76.96 | 83.31,76.96 84.33,75.95 84.33,75.06 U7.72 | 83.31,76.96 83.31,80.77 84.84,82.3 86.11,82.3 U7.84 | 82.17,94.36 82.17,88.77 77.09,83.69 77.09,83.19 77.85,82.42 84.2,82.42 | 84.2,82.42 86.11,82.42 U7.84 | 84.2,82.42 84.2,86.74 85.34,87.88 86.11,87.88 U7.95 91.8,87.85 C27.1 93.22,89.28 93.47,89.53 v94.23,89.53 | 67.31,85.09 67.18,85.09 | 10.16,83.57 10.16,84.2 D15.2 | 10.16,83.57 10.16,80.14 8.76,78.74 8.76,71.5 D18.2 | 66.93,96.27 U7.144 | 67.31,96.27 U7.143 | 66.8,96.14 U7.144
  Top 0.178: 65.02,91.82 U7.6 | 66.8,96.27 U7.144 | v13.72,83.57 10.16,83.57 | 43.56,85.72 v41.4,83.57 | 76.96,71.5 v76.96,71.25
  Top 0.203: 113.61,87.39 R16.1 | R16.1 113.53,87.39 112.46,87.39 112.19,87.12 111.39,87.12 U1.P$27 111.21,87.21 110.33,87.21 109.53,88.01 109.53,89.26 C18.1 109.54,89.38 | 103.75,87.74 U1.P$1 103.83,87.83 103.92,87.92 103.92,89.17 C11.1 103.98,89.22 | R25.1 114.62,86.94 114.15,87.41 R16.1
  Top 0.254: L1.1 46.51,88.76 VR4.P$3 | C41.1 43.41,85.97 | 43.41,85.97 43.41,87.35 | VR4.P$3 45.14,89.92 43.56,89.92 43.56,87.5 43.41,87.35 | 43.41,85.97 43.56,85.81 43.56,85.72 | VR4.P$3 48.46,90.58 51.61,93.73 52.91,93.73 53.26,94.08 54.61,94.08 55.09,93.6 59.47,93.6 C26.1 60.24,93.13 61.42,91.95 | 61.42,91.95 63.65,91.95 63.73,91.87 64.97,91.87 U7.6 | 65.02,91.82 66.24,91.82 66.8,92.38 66.8,94.39 67.06,94.64 67.06,95.91 U7.143 U7.144 | 66.8,96.27 66.8,104.27 v65.15,105.92 64.8,105.56 61.7,105.56 61.14,105.01 S1.3 S1.4 | U7.17 63.11,86.35 v62.74,85.98 | v61.9,88.27 60.86,88.27 60.53,88.59 60.53,90.04 60.68,90.27 61.44,91.03 61.44,91.92 61.42,91.95 | C8.+ 42.87,87.89 43.41,87.35
  Bottom 0.178: 88.9,42.55 81.92,42.55 79.76,40.39 78.87,40.39 | 88.9,42.55 v90.04,42.55 | 78.87,40.39 65.53,40.39 v65.15,40.77 43.43,40.77 v39.62,36.96 27.94,25.27 v27.94,17.27 | v112.39,18.92 110.62,20.7 110.62,20.83 88.9,42.55 | v117.22,87 120.78,90.55 v124.71,90.55 125.86,89.41 125.86,81.66 124.71,80.52 v124.71,75.18 | v108.08,89.15 v105.28,89.15 101.98,89.15 99.82,91.31 99.44,91.31 99.19,91.57 95.25,91.57 94.23,90.55 v94.23,89.53 | SWD.P$1 61.59,109.47 v65.15,105.92 68.45,102.62 v76.2,102.62 | v41.4,83.57 v13.72,83.57 | 78.87,40.39 78.87,69.34 v76.96,71.25
  Bottom 0.254: v62.74,85.98 62.74,87.43 v61.9,88.27
+5V  (via drill 0.3, 0.3 pad 0.81)
  Top 0.178: v102.49,92.58 103.81,92.58 | 103.81,92.58 104.39,92.58 IC7.3 105.02,92.05 C76.1 | IC9.3 65.1,67.65 65.1,64.39 64.41,63.69 | 64.41,63.69 IC9.5 | v64.14,63.75 64.39,63.75 64.41,63.69 | v54.86,66.8 v56.39,65.28 | v47.37,75.95 46.99,75.56 46.61,75.56 | 103.49,92.27 103.81,92.58 | C46.2 45.96,75.7 41.71,79.96 41.71,80.92 C7.+ 41.55,81.1 42.05,81.6
  Top 0.254: C46.2 46.55,75.56 46.61,75.56 | V1.1 35.87,87.04 v36.27,82.04 | v41.6,82.3 42.05,81.85 42.05,81.6 44.58,84.12 v44.58,87.99 | v2.49,69.7 3.05,69.7 v6.3,72.95 | C79.2 13.37,5.59 11.53,5.59 10.92,4.98 v10.92,4.24
  Bottom 0.178: 51.44,92.58 51.31,92.46 51.28,92.38 | v64.14,63.75 57.91,63.75 v56.39,65.28 | v54.86,66.8 54.1,66.8 47.37,73.53 v47.37,75.95 | MORPH.3 22.84,0.51 11.15,0.51 6.35,0.51 5.08,1.78 4.32,1.78 SPREAD.3 4.26,1.85 4.32,1.91
  Bottom 0.254: 51.44,92.58 v102.49,92.58 | v41.6,82.3 41.1,81.84 40.36,81.1 36.4,81.1 36.35,81.15 36.35,81.97 v36.27,82.04 35.53,82.78 29.9,82.78 20.07,72.95 v6.3,72.95 | v44.58,87.99 44.88,87.68 46.51,87.68 51.21,92.38 51.28,92.38 | 4.32,1.91 4.32,7.8 4.65,8.13 4.65,40.28 1.22,43.71 1.22,51.08 0.99,51.31 0.99,68.2 v2.49,69.7 | v10.92,4.24 11.15,4.01 11.15,0.51
+12V  (via drill 0.3)
  Top 0.127: v94.74,52.83 93.73,52.83 IC2.8 | 91.31,58.04 v91.31,56.26 | 91.31,58.04 92.2,58.93 96.77,58.93 100.97,63.12 100.97,70.23 102.49,71.75 104.27,71.75 104.65,72.14 IC5.8 104.78,72.14 105.61,71.35 v109.98,71.12 | v121.92,57.66 124.59,54.99 124.59,53.85 124.33,53.59 124.33,51.82 124.37,51.74 | 44.96,59.94 44.96,63.12 47.75,65.91 47.75,70.99 v45.34,73.41 | 44.96,59.94 44.96,59.05 IC3.8 | IC6.8 15.49,23.88 15.37,24 15.37,26.42 8.84,32.94 8.84,35.31 8.13,36.2 8.13,38.61 11.43,41.91 14.86,41.91 IC4.8 14.99,42.04 15.49,42.04 v16,42.55 | v72.9,58.04 91.31,58.04 | 44.96,59.94 51.13,59.94 51.84,59.28 v52.25,59.05 | v66.22,59.28 66.14,59.36 66.14,60.68 66.36,60.89 IC9.8
  Top 0.178: 124.42,51.43 124.1,51.12 124.1,47.92 | 124.42,51.43 124.46,51.47 124.99,51.47 IC1.8 | 104.72,72.19 IC5.8 | 124.37,51.74 124.37,51.47 124.42,51.43
  Top 0.203: IC8.8 124.1,46.14 124.1,47.92
  Top 0.254: C4.+ 35.59,96.13 | 35.59,96.13 35.58,95.63 VR4.P$1 | 32.77,87.63 V1.3 | C3.1 30.34,85.14 | C78.1 33.53,89.24 V1.3 | C3.1 30.79,81.79 v31.19,81.38 30.25,82.33 D19.K | v38.3,79.32 38.3,78.28 41.66,74.93 44.07,74.93 v44.32,74.68 | V1.3 29.89,87.52 29.69,87.33 29.69,85.79 C3.1 | V-SEL.P$3 33.39,89.23 C78.1 | C78.1 33.62,94.16 35.59,96.13
  Bottom 0.127: v91.31,56.26 v94.74,52.83 | v121.92,57.66 121.92,61.59 111.89,71.63 110.49,71.63 v109.98,71.12 | 45.34,73.66 v45.34,73.41 45.34,72.77 42.52,70.36 42.52,69.09 36.32,63.25 25.15,63.25 16,54.1 v16,42.55 | v72.9,58.04 67.18,58.04 65.94,59.28 | v52.25,59.05 53.92,59.05 54.81,59.94 57.78,59.94 58.04,59.69 65.53,59.69 65.94,59.28 | 65.94,59.28 v66.22,59.28
  Bottom 0.254: v31.19,81.38 31.22,81.38 33.25,79.35 38.28,79.35 v38.3,79.32 | v44.32,74.68 44.32,74.42 v45.34,73.41
-12V  (via drill 0.3, 0.38)
  Top 0.127: v98.55,55.24 98.93,54.86 99.44,54.86 IC2.4 | v103.38,58.93 v100.84,58.93 | v109.47,74.17 110.49,74.17 IC5.4 | v17.53,29.34 12.57,34.29 12.57,36.2 17.14,40.77 | 17.14,40.77 20.19,43.81 20.7,43.81 IC4.4 | IC6.4 17.53,17.91 v17.53,16.89 17.88,16.54 18.44,16.54 18.69,16.28 18.69,15.47 17.5,14.28 v17.5,10.85 | 35.94,53.21 35.56,52.83 35.56,49.28 32.89,46.61 32.89,43.94 29.72,40.77 17.14,40.77 | 35.94,53.21 36.45,53.72 | 36.45,53.72 37.47,54.74 37.85,54.74 38.99,55.88 38.99,56.9 IC3.4 | 36.45,53.72 v33.53,56.64 | v120.02,34.04 120.02,44.07 IC8.4 | v98.42,14.61 96.14,16.89 93.6,16.89 93.34,17.14 82.93,17.14 77.09,11.3 76.83,11.3 75.82,10.29 75.82,7.49 75.56,7.24 54.86,7.24 54.61,7.49 44.45,7.49 v41.78,4.83 | v64.01,66.67 64.39,66.67 64.39,67.69 IC9.4 | v61.59,64.39 61.59,61.92 v61.21,61.59 | v50.93,64.39 50.93,62.87 51.82,61.98 51.82,61.09 51.69,61.09 50.93,60.33 47.37,60.33 v47.24,60.45 | v40.01,52.58 39.37,53.21 35.94,53.21
  Top 0.178: v119.13,48.72 119.13,49.52 IC1.4 | 111.21,74.77 110.95,74.5 110.86,74.5 110.59,74.23 IC5.4
  Top 0.203: v119.13,48.72 119.15,48.72 121.16,46.71 121.16,44.12 120.1,44.12 IC8.4
  Top 0.254: D13.A 32.61,70.7 C47.- 32.38,70.66 29.82,68.1 29.82,62.97 v29.08,62.23
  Bottom 0.127: v98.55,55.24 98.55,56.64 v100.84,58.93 | v103.38,58.93 108.97,58.93 113.79,54.1 | 113.79,54.1 119.13,48.77 v119.13,48.72 | v109.47,74.17 109.47,71.02 108.71,70.41 108.71,65.41 107.57,64.26 107.57,62.99 111.51,59.05 113.28,59.05 113.79,58.55 113.79,54.1 | v29.08,62.23 29.08,61.09 v33.53,56.64 | v120.02,34.04 120.02,30.1 114.05,24.13 114.05,18.03 105.41,9.4 103.63,9.4 v98.42,14.61 | v41.78,4.83 22.99,4.83 17.5,10.31 v17.5,10.85 | v64.01,66.67 61.72,64.39 v61.59,64.39 | v61.21,61.59 60.83,61.59 59.31,63.12 56.64,63.12 55.37,64.39 v50.93,64.39 | v47.24,60.45 47.24,59.44 46.1,58.29 45.47,58.29 42.29,55.12 40.77,55.12 40.64,54.99 40.64,53.21 v40.01,52.58 | v17.53,16.89 v17.53,29.34
  Bottom 0.178: 121.08,51.21 121.08,50.67 v119.13,48.72
ADC-VDD  (via drill 0.3)
  Top 0.178: U7.32 U7.33 62.2,78.35 C10.1 61.09,77.34 v59.44,77.34 | D12.2 106.3,17.27 106.3,14.22 QVAL.3 | v113.16,58.42 114.05,57.53 D5.2 | v96.52,59.56 95,61.09 D6.2 94.87,61.09 93.34,59.56 78.36,59.56 D7.2 78.23,59.56 v78.23,60.71 | v104.39,28.19 v103.38,27.18 | v5.46,9.53 5.46,10.67 D11.2 5.46,10.81 v5.46,13.79 | v20.57,1.27 21.59,2.29 D4.2 | v23.88,61.21 22.86,61.21 D10.2 22.73,61.09 21.84,60.2 17.91,60.2 15.24,57.53 15.24,57.4 | v40.64,63.5 40.64,62.36 D9.2 | v56.26,61.98 56.26,60.83 D8.2 | v46.61,79.76 46.61,81.53 C31.+ | 15.24,57.4 15.24,51.18 6.81,42.7 v6.81,42.22 | 15.24,57.4 v11.81,57.4 | FREQNUDGE1.3 120.94,97.52 C73.1 | C74.1 101.59,17.86 v102.89,17.86 | 113.93,57.32 113.93,55.88 C77.1
  Top 0.254: 113.93,57.32 D5.2 | C31.+ 46.41,81.73 46.41,84.3 46.53,84.56 L1.2 | C80.1 5.46,12.94 v5.46,13.79
  Bottom 0.178: FREQNUDGE1.3 120.4,98.04 114.3,98.04 112.65,99.69 107.44,99.69 SLIDE1.P$3 107.31,99.82 106.05,99.82 104.65,101.22 100.46,101.22 99.06,99.82 90.93,99.82 SLIDE2.P$3 90.81,99.82 89.66,100.97 81.92,100.97 80.77,99.82 74.42,99.82 SLIDE3.P$3 74.3,99.82 71.09,99.82 69.9,100.97 59.05,100.97 57.91,99.82 SLIDE4.P$3 57.78,99.82 54.51,99.82 53.42,100.99 40.13,100.97 | 40.13,100.97 41.27,99.82 SLIDE5.P$3 | 40.13,100.97 39.88,101.22 35.92,101.22 34.52,99.82 24.89,99.82 SLIDE6.P$3 24.77,99.69 23.62,98.55 19,98.55 18.16,99.57 6.73,99.57 5.21,98.04 | 5.21,98.04 4.45,98.04 FREQNUDGE6.3 5.21,98.04 | v113.16,58.42 109.98,58.42 108.84,59.56 101.47,59.56 | v96.52,59.56 101.47,59.56 | v103.38,27.18 103.76,27.18 110.24,20.7 110.24,18.92 106.3,14.99 106.3,14.22 QVAL.3 106.22,14.53 v102.89,17.86 | v104.39,28.19 104.39,45.85 101.47,48.77 101.47,59.56 | v5.46,9.53 7.11,9.53 15.37,1.27 v20.57,1.27 | v23.88,61.21 25.53,62.87 40.01,62.87 v40.64,63.5 46.61,63.5 | 46.61,63.5 50.42,63.5 51.94,61.98 v56.26,61.98 58.17,60.07 72.9,60.07 73.53,60.71 v78.23,60.71 | 46.61,63.5 v46.61,79.76 46.74,79.88 51.18,79.88 53.72,77.34 v59.44,77.34 | 5.21,98.04 5.21,69.22 8.26,66.17 8.26,60.96 v11.81,57.4 | v5.46,13.79 5.44,40.84 v6.81,42.22
AGND  (via drill 0.3)
  Top 0.127: 117.47,68.25 117.47,68.2 C21.- | 104.9,97.54 IC7.1 | 107.95,81.28 107.95,81.29 | 56.01,48.77 56.01,48.74
  Top 0.178: 125.08,48.62 125.08,49.52 IC1.5 | 125.08,48.62 125.08,48.45 | 119.84,50.14 119.22,50.14 IC1.3 | 104.3,81.28 U1.P$11 | U1.P$18 111.28,81.28 110.33,81.28 110.01,80.96 110.01,79.31 110.54,79.34 111.24,79.29 | 109.22,76.36 109.22,76.4 | 121.19,49.57 v122.1,48.67 | v125.83,48.64 125.11,48.64 125.08,48.62
  Top 0.203: R194.1 106.68,75.88 R191.1 108.57,76.4 109.22,76.4 110.95,76.4 111.21,76.67 C14.2 111.24,79.29 111.21,79.25 U1.P$15 | U1.P$11 103.85,81.23 104.34,81.23 104.4,81.29 107.95,81.29 U1.P$18 113.99,81.29 C20.2 114.92,80.63 114.94,78.51 114.94,75.31 115.27,74.75 115.27,73.25 118.47,73.23 118.49,68.28 117.6,68.25 117.63,68.25 | 117.63,68.25 117.47,68.25 112.29,68.17 112.09,67.89 112.09,65.25 109.58,62.76 109.58,49.07 109.25,48.74 56.01,48.74 36.73,48.74 36.09,48.11 36.09,44.96 32.61,41.48 32.61,38.79 28.63,34.8 28.63,34.35 27.74,33.47 | 104.14,96.91 C17.2 102.45,97.03 C58.- | 117.63,68.25 126.14,68.25 126.29,68.1 126.29,68.07 126.72,67.64 126.72,64.44 126.64,64.36 126.64,59.99 126.26,59.61 121.51,59.61 v120.45,58.55 | v122.17,55.5 122.17,52.05 120.45,50.32 | 120.45,50.32 119.3,50.32 IC1.3 | 125.08,48.45 125.08,48.35 127,46.43 128.32,46.43 | 121.19,49.57 120.45,50.32
  Top 0.254: 27.74,33.47 27.11,32.84 R190.2 27,32.04 27,31.06 26.95,31.01 20.42,31.01 19.41,32.03 15.7,32.03 15.7,32.59 v15.62,32.66 | R189.2 12.1,31.95 v13.11,31.95 | 107.95,81.28 107.95,82.22 106.38,83.8 106.38,89.31 106.63,89.56 106.63,90.49 C76.2 106.72,93.46 106.6,93.57 106.6,95.73 104.9,97.43 104.9,97.54 104.9,99.85 AGND.P$1 | 128.32,46.43 128.42,46.33 | 128.42,46.33 128.65,46.1 128.65,43.43 128.04,42.82 125.96,42.82 125.65,42.32 125.65,41.2 125.83,41.02 126.44,41.02 126.59,40.95 126.59,28.63 125.04,27.08 AGND-OPT.P$1 | 128.42,46.53 128.42,46.33 | 104.14,96.91 IC7.1
  Bottom 0.178: v122.1,48.67 125.81,48.67 v125.83,48.64
  Bottom 0.203: v120.45,58.55 120.45,57.23 v122.17,55.5
  Bottom 0.254: v13.11,31.95 13.82,32.66 v15.62,32.66
BANDADC1  (via drill 0.3)
  Top 0.127: 110.74,59.69 110.74,59.82 111.51,60.58 | 110.74,59.69 110.74,59.44 R38.1 110.74,59.69 | 111.51,60.58 111.89,60.96 R68.1 111.51,60.58 | 110.74,59.69 113.03,59.69 D5.3 | v65.02,76.2 65.02,76.83 U7.36 | v95.38,79.38 97.03,79.38 v99.95,76.45 | v108.46,63.63 v106.3,65.79 | 111.51,60.58 v111,61.09
  Bottom 0.127: v65.02,76.2 65.02,76.71 67.69,79.38 71.75,79.38 72.01,79.12 77.22,79.12 77.98,78.36 79.25,78.36 79.38,78.49 84.45,78.49 84.58,78.36 87.38,78.36 88.39,79.38 v95.38,79.38 | v99.95,76.45 99.95,69.6 103.76,65.79 v106.3,65.79 | v111,61.09 v108.46,63.63
BANDADC2  (via drill 0.3)
  Top 0.127: R69.1 95.63,63.37 93.98,63.37 D6.3 93.85,63.37 91.69,63.37 R39.1 91.57,63.5 v90.81,64.26 | v67.31,77.98 66.93,77.6 66.93,75.06 U7.37
  Bottom 0.127: v67.31,77.98 70.36,77.98 70.74,78.36 71.37,78.36 77.85,71.88 81.41,71.88 89.03,64.26 v90.81,64.26
BANDADC3  (via drill 0.3)
  Top 0.127: 77.22,61.98 77.34,61.85 D7.3 77.22,61.98 | 77.22,61.98 76.07,63.12 R40.1 75.95,63.25 v75.18,64.01 | 77.22,61.98 78.61,63.37 R70.1 | v70.36,73.15 69.34,74.17 69.34,74.93 U7.42
  Bottom 0.127: v70.36,73.15 70.99,72.52 71.55,72.08 71.55,71.2 70.56,70.28 70.59,68.33 v75.18,64.01
BANDADC4  (via drill 0.3)
  Top 0.127: 54.74,63.5 R41.1 | 54.74,63.5 55.24,62.99 D8.3 | 54.74,63.5 57.53,63.5 R71.1 57.66,63.63 v58.42,64.39 | v69.72,76.33 69.72,75.06 U7.43
  Bottom 0.127: v69.72,76.33 69.72,75.69 v58.42,64.39
BANDADC5  (via drill 0.3)
  Top 0.127: R42.1 37.47,64.14 39.37,64.14 39.75,64.52 D9.3 39.88,64.64 40.39,65.15 42.67,65.15 R72.1 42.8,65.28 43.69,66.17 v47.24,66.17 | v63.12,81.79 64.9,81.79 U7.26
  Bottom 0.127: v63.12,81.79 63.12,80.9 60.58,78.36 60.58,71.07 61.42,70.21 61.44,69.11 58.17,66.17 v47.24,66.17
BANDADC6  (via drill 0.3)
  Top 0.127: 21.84,63.5 21.59,63.75 19.68,63.75 R43.1 | 21.84,63.5 22.23,63.88 24,63.88 R73.1 24.13,64.01 v24.89,64.77 | 21.84,63.5 D10.3 | v59.69,81.28 64.9,81.28 U7.27 | v58.42,82.55 57.91,83.06 v57.15,83.06 | v34.42,69.47 v36.32,71.37
  Bottom 0.127: v58.42,82.55 v59.69,81.28 | v57.15,83.06 56.77,83.06 54.48,80.77 45.72,80.77 v36.32,71.37 | v34.42,69.47 34.04,69.47 29.34,64.77 v24.89,64.77
BANKSCALE  (via drill 0.3)
  Top 0.127: v84.84,83.19 85.09,82.93 86.11,82.93 U7.85 | v79.63,77.98 v83.44,81.79 | v104.52,60.2 104.52,56.95 107.09,56.95 107.64,56.39 v108.33,56.39
  Top 0.178: BANKSCALE-SW.P$2 123.01,7.42 127.38,11.76 127.33,41.6 v126.44,41.94
  Bottom 0.127: v83.44,81.79 v84.84,83.19 | v79.63,77.98 78.87,77.98 78.11,77.22 78.11,76.71 82.42,72.39 94.11,72.39 99.69,66.8 99.69,63.37 102.87,60.2 v104.52,60.2 | v108.33,56.39 117.98,46.74 117.98,42.14
  Bottom 0.178: v126.44,41.94 118.19,41.94 117.98,42.14
CODEC-VDD  (via drill 0.3)
  Top 0.203: R183.2 102.68,78.22 U1.P$14 103.81,79.35 103.83,79.32 v106.3,79.32 | IC7.2 104.15,95.21 C17.1 100.39,95.21 C58.+ 100.35,95.17 104.24,95.17 105.08,94.34 105.77,94.34 105.89,94.21 105.89,83.36 105.77,83.24 | 105.77,83.24 U1.P$8 | v106.5,81.97 105.77,82.7 105.77,83.24
  Top 0.254: IC7.4 v112.34,94.92 | v105.97,95.12 104.65,95.12 IC7.2
  Bottom 0.203: v106.3,79.32 106.5,79.53 v106.5,81.97
  Bottom 0.254: v112.34,94.92 106.17,94.92 v105.97,95.12
DAC0  (via drill 0.3)
  Top 0.127: v68.45,80.39 68.45,75.06 U7.40 | v103,93.85 v98.93,89.79
  Bottom 0.127: v68.45,80.39 83.69,80.39 83.95,80.14 92.71,80.14 92.96,79.88 94.87,79.88 98.93,83.95 v98.93,89.79 | v103,93.85 112.65,93.85 113.41,94.61 121.79,94.61 127,89.41 127,55.24 127.38,54.86 127.38,35.43 121.67,29.72 IN-1.3
ENV_FAST  (via drill 0.3)
  Top 0.127: v69.37,98.09 71.2,98.09 72.26,97.03 72.26,96.27 U7.133 | v55.12,98.17 52.58,98.17 42.93,107.82 41.15,107.82 40.01,106.68 38.73,106.68 37.97,105.92 36.45,105.92 36.07,106.3 36.07,107.31 34.92,108.46 16,108.46 13.08,105.54 13.08,97.16 v4.57,88.65
  Bottom 0.127: v55.12,98.17 v69.37,98.09 | v4.57,88.65 4.57,67.69 1.65,64.77 1.65,51.56 7.75,45.47 SLOWFAST-SW.P$1
ENV_SLOW  (via drill 0.3)
  Top 0.127: v78.61,73.66 78.36,73.91 78.36,74.93 U7.60 | v73.66,78.61 73.66,81.15 67.31,87.5 v67.31,90.3 | v13.59,92.71 9.4,92.71 4.83,88.14 1.4,88.14 0.38,87.12 0.38,47.75 2.67,45.47 SLOWFAST-SW.P$3
  Bottom 0.127: v73.66,78.61 v78.61,73.66 | v67.31,90.3 67.94,90.3 68.83,91.19 68.83,91.69 68.58,91.95 55.37,91.95 49.4,85.98 20.32,85.98 v13.59,92.71
ENVPWM1  (via drill 0.3)
  Top 0.127: v101.47,67.31 101.47,63.25 98.17,59.94 98.17,58.04 R9.2 | v94.61,84.07 v99.19,79.5 | v88.65,89.28 86.23,89.28 U7.98
  Bottom 0.127: v101.47,67.31 97.92,70.87 97.92,78.23 v99.19,79.5 | v94.61,84.07 89.41,89.28 v88.65,89.28
ENVPWM2  (via drill 0.3)
  Top 0.127: v91.82,57.78 92.84,57.78 R32.2 | v99.19,71.12 v96.52,68.45 | v99.19,76.45 96.27,76.45 94.61,78.11 v94.61,82.55 | v87.5,89.79 86.23,89.79 U7.99
  Bottom 0.127: v91.82,57.78 91.82,59.44 96.52,64.14 v96.52,68.45 | v99.19,76.45 v99.19,71.12 | v94.61,82.55 87.5,89.66 v87.5,89.79
ENVPWM3  (via drill 0.3)
  Top 0.127: v36.7,54.99 35.94,55.75 R52.2 | v45.47,62.36 45.47,62.74 v47.62,64.9 | v61.34,76.2 61.85,75.69 61.85,75.18 61.59,74.93 61.59,74.02 61.9,73.66 61.9,69.09 v61.57,68.35 | v78.99,83.95 85.34,90.3 86.11,90.3 U7.100
  Bottom 0.127: v36.7,54.99 42.04,60.33 43.43,60.33 v45.47,62.36 | v47.62,64.9 51.18,64.9 52.2,65.91 58.67,65.91 v61.57,68.35 | v61.34,76.2 61.34,76.83 68.45,83.95 v78.99,83.95
ENVPWM4  (via drill 0.3)
  Top 0.127: v50.55,55.88 48.39,55.88 48.26,56.01 46.86,56.01 46.61,55.75 46.61,54.74 46.35,54.48 43.81,54.48 42.8,55.5 42.42,55.5 R54.2 | v58.93,58.93 58.93,59.31 60.71,61.09 v60.71,65.91 | v70.23,76.83 70.74,76.83 73.15,79.25 v73.15,80.9 | v77.72,83.44 77.72,83.69 85.34,91.31 86.11,91.31 U7.102
  Bottom 0.127: v50.55,55.88 50.93,55.88 51.56,56.52 53.21,56.52 55.12,58.42 58.42,58.42 v58.93,58.93 | v60.71,65.91 60.71,66.29 70.23,75.82 v70.23,76.83 | v73.15,80.9 75.18,80.9 v77.72,83.44
ENVPWM5  (via drill 0.3)
  Top 0.127: v34.16,51.56 34.16,50.93 27.43,44.2 25.02,44.2 24.51,43.69 24.13,43.69 R56.2 | v48.9,62.87 48.9,67.69 50.16,68.96 50.16,74.55 49.73,74.98 49.71,75.82 52.63,78.74 54.48,78.74 54.86,79.12 v54.86,82.68 | v68.33,91.44 68.33,91.95 69.85,93.47 v69.85,93.73 | v71.25,94.87 71.75,95.38 71.75,96.14 U7.134
  Bottom 0.127: v34.16,51.56 36.32,53.72 37.08,53.72 43.43,60.07 44.83,60.07 47.62,62.87 v48.9,62.87 | v54.86,82.68 55.24,82.68 64.14,91.57 68.2,91.57 v68.33,91.44 | v69.85,93.73 70.1,93.73 v71.25,94.87
ENVPWM6  (via drill 0.3)
  Top 0.127: v59.16,97.28 40.66,97.26 40.11,97.26 37.97,99.39 37.97,100.1 37.01,101.07 33.93,101.07 31.37,97.99 25.98,97.99 25.43,97.94 18.39,97.94 14.12,102.21 v13.74,102.21 | R58.2 15.62,47.12 15.62,47.8 15.04,48.39 v15.04,49.07 | 71.25,96.27 U7.135 71.27,96.27 71.27,97.38 71.09,97.56 v70.31,97.56 | v2.62,92.71 5.99,92.71 v6.53,92.18 | v10.36,73.86 10.36,70.76 v10.46,70.66
  Top 0.178: 15.65,47.03 R58.2
  Bottom 0.127: v59.16,97.28 69.34,97.28 v70.31,97.56 | v2.62,92.71 2.39,92.94 2.39,98.73 4.52,100.53 12.68,100.53 13.74,101.6 v13.74,102.21 | v6.53,92.18 6.53,74.73 6.43,74.62 9.6,74.62 v10.36,73.86 | v10.46,70.66 10.46,66.88 10.95,66.4 10.95,59.56 13.28,57.23 13.28,50.83 v15.04,49.07
FREQCV1ADC  (via drill 0.3)
  Top 0.127: 123.95,93.98 123.83,93.98 D16.3 123.95,93.98 | 123.95,93.98 125.35,93.98 | 125.35,93.98 126.11,93.98 R126.2 | 125.35,93.98 127,95.63 R129.1 | v71.37,73.79 71.37,74.93 U7.46 | v77.98,66.67 80.39,64.26 v86.23,64.26 | v91.69,66.04 96.65,66.04 v100.46,69.85 | v113.28,77.72 v111.89,76.33 | v123.44,87.25 123.95,87.76 123.95,93.98
  Bottom 0.127: v71.37,73.79 71.75,73.79 73.05,70.76 73.13,68.73 v77.98,66.67 | v86.23,64.26 88.65,64.26 89.15,63.75 91.06,63.75 91.69,64.39 v91.69,66.04 | v100.46,69.85 100.71,69.85 101.83,68.61 105.64,68.63 106.07,69.01 106.07,72.49 110.87,76.33 v111.89,76.33 | v113.28,77.72 115.82,77.72 123.44,85.34 v123.44,87.25
FREQCV6ADC  (via drill 0.3)
  Top 0.127: 4.06,86.74 2.67,86.74 2.03,87.38 R125.2 | 4.06,86.74 5.21,86.74 R130.1 | 13.84,90.68 9.65,86.49 9.4,86.49 D15.3 | 13.84,90.68 13.84,91.69 13.08,92.46 9.78,92.46 4.06,86.74 | v70.87,72.01 71.88,73.03 71.88,74.93 U7.47 | v61.59,66.42 57.12,67.21 v54.1,68.35 | v48.28,78.46 47.62,79.12 v47.62,81.79 | 13.84,90.68 v14.1,90.42
  Bottom 0.127: v70.87,72.01 68.58,72.01 67.56,70.99 67.56,70.48 66.93,69.85 65.02,69.85 v61.59,66.42 | v54.1,68.35 54.08,72.59 v48.28,78.46 | v47.62,81.79 43.94,81.79 40.01,85.72 18.8,85.72 v14.1,90.42
FREQNUDGEADC1  (via drill 0.3)
  Top 0.127: C71.1 123.44,100.08 123.44,98.42 123.06,98.04 FREQNUDGE1.2 | v66.55,80.9 65.02,80.9 U7.28 | v81.03,89.92 v73.53,82.42 | v94.11,93.47 v92.33,91.69
  Bottom 0.127: v66.55,80.9 71.37,80.9 72.9,82.42 v73.53,82.42 | v81.03,89.92 81.03,91.69 81.28,91.95 92.08,91.95 v92.33,91.69 | v94.11,93.47 101.47,100.84 104.52,100.84 107.06,98.3 113.54,98.3 115.06,96.77 121.79,96.77 122.94,97.92 FREQNUDGE1.2
FREQNUDGEADC6  (via drill 0.3)
  Top 0.127: C72.1 8.13,95.38 8.13,96.77 6.99,97.92 FREQNUDGE6.2 | v60.07,80.26 64.9,80.26 U7.29 | v50.93,79.25 50.93,84.33 v48.77,86.49
  Bottom 0.127: v60.07,80.26 60.07,77.22 59.56,76.71 53.47,76.71 v50.93,79.25 | v48.77,86.49 22.61,86.49 9.91,99.19 8.13,99.19 6.99,98.04 FREQNUDGE6.2
GND  (via drill 0.3)
  Top 0.178: 88.14,93.85 90.76,93.85 C28.2 92.33,95.25 93.98,95.25 94.61,94.61 | 88.14,93.85 U7.107 | C27.2 93,87.35 U7.94 | C24.2 92.44,81.85 U7.83 | C23.2 73.84,71.97 U7.51 73.91,75.06 73.91,75.95 74.04,76.07 78.61,76.07 78.87,75.82 78.87,75.06 U7.61 | 60.02,91.49 60.01,91.49 C26.2 58.37,91.44 | C25.2 72.97,101.06 72.97,98.96 73.84,98.04 U7.130 | 58.37,91.44 58.37,92.28 58.09,92.56 54.88,92.56 C32.1 54.14,92.57 54.03,92.46 54.03,79.74 C33.1 53.72,79.38 52.7,79.38 50.62,77.29 46.86,73.53 | 58.37,91.44 58.37,88.59 60.12,86.85 U7.16 | 41.86,86.12 C41.2 41.49,84.49 C7.- | POWER.14 POWER.12 POWER.10 | C46.1 37.54,74 34.25,74 33.78,73.53 33.78,68.45 33.65,68.33 | POWER.11 POWER.9 14.55,84.12 13.03,85.34 9.65,85.34 8.64,84.33 8.38,84.33 D15.1 8.26,84.33 7.62,84.96 | 33.65,68.33 C47.+ 32.56,66.12 31.6,65.15 31.6,61.75 31.75,61.59 | 119,79.63 119.51,79.12 119.51,77.34 | 119,79.63 115.44,83.19 111.38,83.19 U1.P$21 | 119,79.63 122.3,79.63 U$1.MTN2 | 119.51,77.34 117.22,77.34 LOCK_135.2 | 119.51,77.34 LOCK_135.3 119.63,77.22 122.81,74.04 D17.1 122.94,73.91 123.19,73.91 124.08,73.03 126.36,73.03 127.51,74.17 127.51,76.07 126.87,76.71 126.87,78.74 127.76,79.63 U$1.MTN1 127.89,79.76 127.89,85.47 | 113.92,101.73 113.92,100.08 S0.2 113.92,99.95 113.92,93.6 S0.1 | 113.92,101.73 113.92,103.63 | 113.92,103.63 113.92,104.14 C12.2 113.67,103.89 | 113.92,103.63 113.67,103.89 | 113.67,103.89 113.16,104.39 | 113.16,104.39 111.89,105.66 C34.2 | 113.92,101.73 104.9,101.73 | 113.16,104.39 111.25,104.39 LOCK1.P$6 | 113.67,103.89 113.67,106.81 LOCK1.P$8 | C18.2 111.25,89.41 111.25,90.93 113.79,93.47 S0.1
  Top 0.178: S0.1 113.92,93.47 114.81,93.47 117.09,91.19 FREQCV1.2 FREQCV1.3 122.81,91.19 | 127.89,85.47 127.89,88.65 U$1.MTN3 | 123.51,95.44 122.94,94.87 122.94,91.82 D16.1 | 123.51,95.44 123.7,95.63 125.35,95.63 R129.2 125.5,95.77 FREQNUDGE1.1 125.23,98.3 C71.2 | 122.43,86.87 122.43,88.65 U$1.MTN4 122.43,88.77 122.81,89.15 122.81,91.19 | 122.43,86.87 122.43,85.85 U$1.GND | 122.81,91.19 122.81,91.69 D16.1 | 127.89,85.47 123.83,85.47 122.43,86.87 | 122.81,91.19 D16.1 | C37.2 56.01,104.9 56.52,104.39 LOCK4.P$6 56.64,104.39 59.05,106.81 LOCK4.P$8 59.18,106.93 64.14,106.93 66.67,109.47 | C25.2 74.17,102.36 73.28,103.25 72.9,103.25 71.5,104.65 70.1,104.65 R26.2 70.1,104.78 69.6,105.28 69.6,106.93 67.06,109.47 66.67,109.47 | 77.6,104.9 78.11,104.39 LOCK3.P$6 78.23,104.39 79.25,105.41 | 77.6,104.9 77.34,105.16 77.34,106.17 C30.2 | 79.25,105.41 80.64,106.81 LOCK3.P$8 | 77.6,104.9 75.18,102.49 74.42,102.49 C25.2 | 79.25,105.41 79.25,102.62 C22.2 78.84,102.02 U7.120 78.87,96.14 78.87,95.25 79.25,94.87 87.12,94.87 88.14,93.85 | 66.67,109.47 SWD.P$3 | C16.2 94.61,107.57 96.52,107.57 97.16,106.93 LOCK2.P$8 | 96.39,89.15 94.74,89.15 93.22,87.63 C27.2 | 96.39,89.15 102.23,89.15 C11.2 | C24.2 92.58,81.66 92.58,74.04 91.19,72.64 91.19,72.39 C29.2 91.06,72.26 90.81,70.84 90.81,69.55 | C27.2 93.22,87.5 93.98,86.74 93.98,82.93 92.71,81.66 C24.2 | 94.61,94.61 96.39,92.84 96.39,89.15 | 94.61,94.61 94.61,101.6 | 94.61,101.6 94.61,104.27 LOCK2.P$6 | 90.81,69.55 90.7,69.32 86.74,66.55 85.85,66.55 R48.2 85.85,66.42 85.85,65.53 86.87,64.52 86.87,61.59 BANDCV2.2 88.2,60.15 90.42,60.15 91.38,61.1 D6.1 92.2,61.1 R39.2